# EAGLE design SIngle_Breakout_X128_0002 (EAGLE 7.2.0)
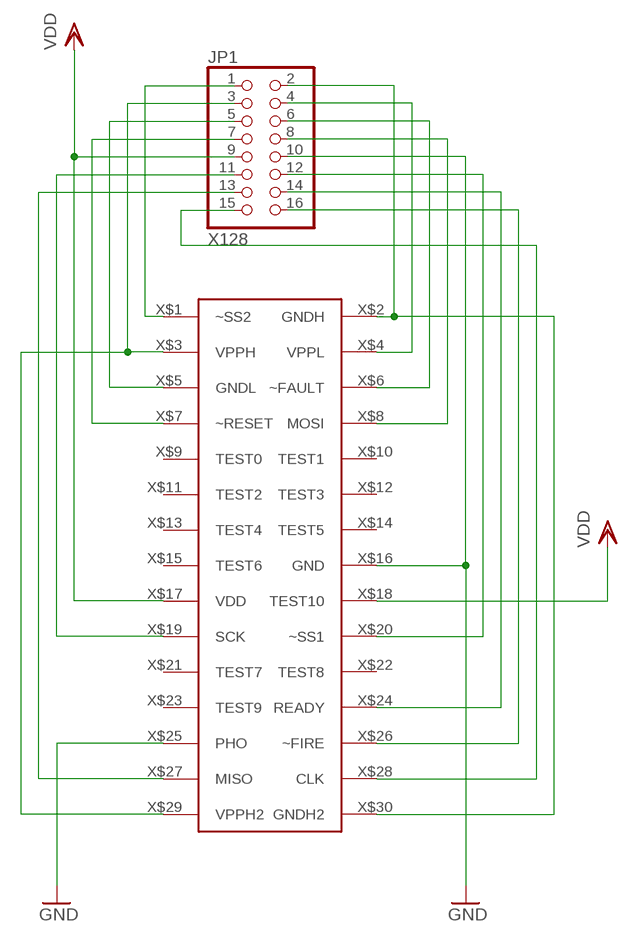
[diagram p0: schematic, sheet 1]

## Parts
JP1  X128  PINHD-2X8  [2X08]
U$1  XAAR_CONN_PHYS  [XAAR_128]

## Nets
GND: JP1.10 U$1.X$16(GND) U$1.X$25(PHO)
N$1: JP1.1 U$1.X$1(~SS2)
N$2: JP1.3 U$1.X$3(VPPH) U$1.X$29(VPPH2)
N$3: JP1.5 U$1.X$5(GNDL)
N$4: JP1.7 U$1.X$7(~RESET)
N$6: JP1.11 U$1.X$19(SCK)
N$7: JP1.13 U$1.X$27(MISO)
N$9: JP1.2 U$1.X$2(GNDH) U$1.X$30(GNDH2)
N$10: JP1.4 U$1.X$4(VPPL)
N$11: JP1.6 U$1.X$6(~FAULT)
N$12: JP1.8 U$1.X$8(MOSI)
N$14: JP1.12 U$1.X$20(~SS1)
N$15: JP1.14 U$1.X$24(READY)
N$16: JP1.16 U$1.X$26(~FIRE)
N$17: JP1.15 U$1.X$28(CLK)
VDD: JP1.9 U$1.X$17(VDD) U$1.X$18(TEST10)
Unconnected: U$1.X$9(TEST0) U$1.X$10(TEST1) U$1.X$11(TEST2) U$1.X$12(TEST3) U$1.X$13(TEST4) U$1.X$14(TEST5) U$1.X$15(TEST6) U$1.X$21(TEST7) U$1.X$22(TEST8) U$1.X$23(TEST9)

## Library data of the parts
JP1 = pinhead:PINHD-2X8: PIN HEADER
U$1 = matt4eagle:XAAR_CONN_PHYS

## Board
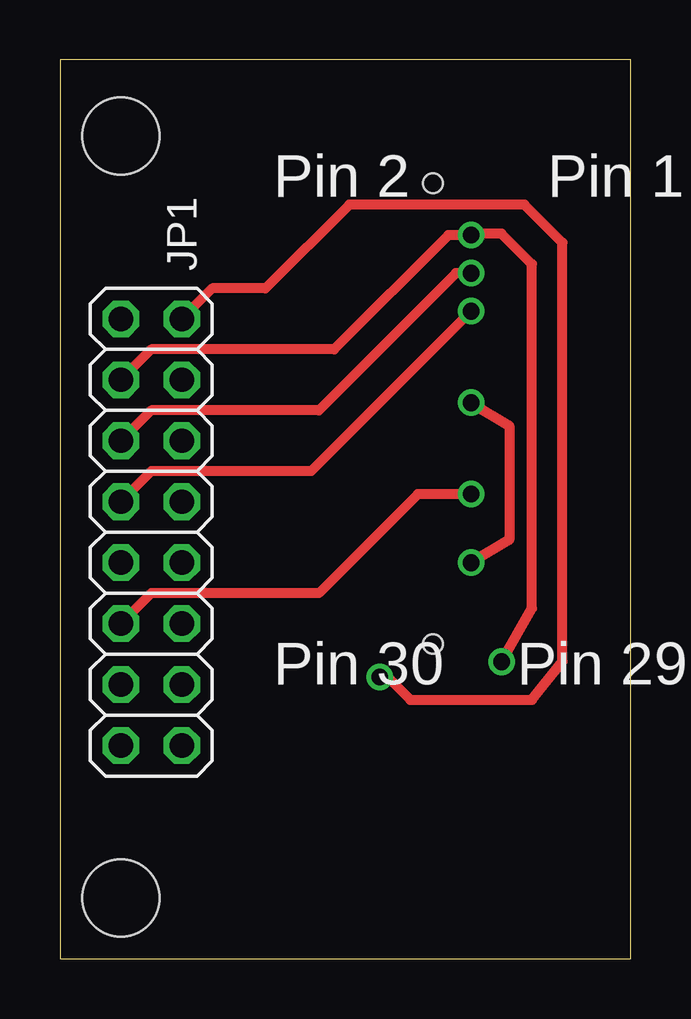
[diagram p1: board, top side]
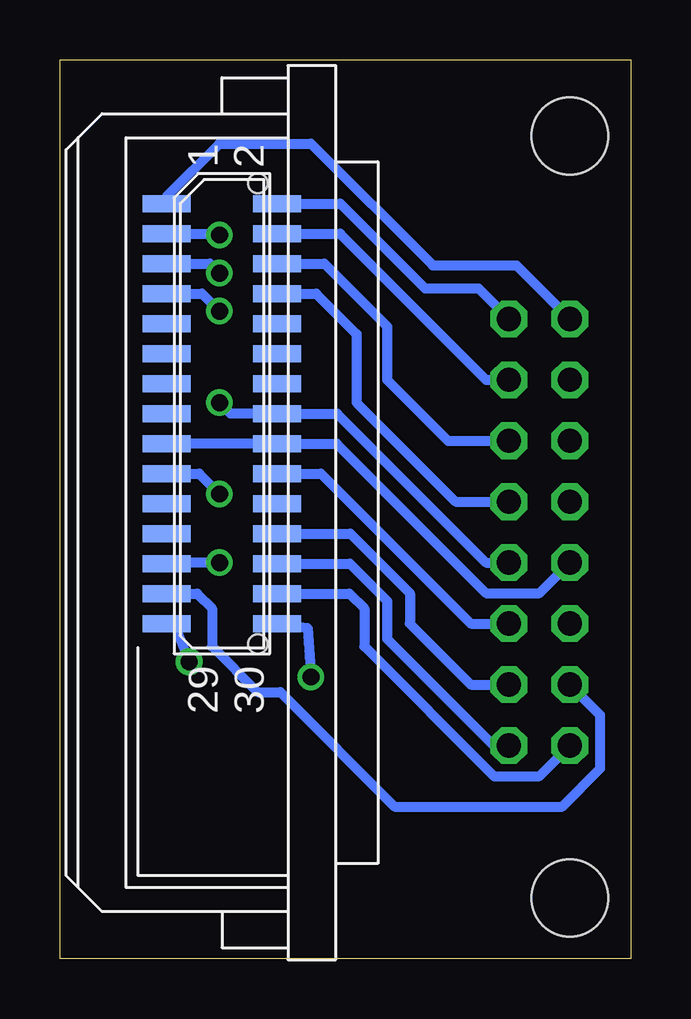
[diagram p2: board, bottom side, seen from below]

Size 23.8 x 37.45 mm. Coordinates in mm from the lower left corner, seen from the top.
Outline: 0,0 23.8,0 23.8,37.45 0,37.45 0,0
Copper layers (1*16): Top 0.035mm / dielectric 1.5mm / Bottom 0.035mm
Design rules "default": minimum track width 10mil, minimum drill 24mil, track to track 8mil, track to pad 8mil, pad to pad 8mil, via to via 8mil, smd to smd 8mil, copper to edge 40mil, drill to drill 8mil, minimum pad ring 10mil, minimum via ring 8mil, stop-mask expansion 4mil, vias tented up to drill 0mil, thermal gap 10mil
Holes 3.2 mm at 2.54,34.29 2.54,2.54

### Footprints (pad centres in the part's own frame; a part is rotated, then mirrored left to right if it is on the bottom)
2X08 = drill 1.016 octagon: 1 -8.89,-1.27; 2 -8.89,1.27; 3 -6.35,-1.27; 4 -6.35,1.27; 5 -3.81,-1.27; 6 -3.81,1.27; 7 -1.27,-1.27; 8 -1.27,1.27; 9 1.27,-1.27; 10 1.27,1.27; 11 3.81,-1.27; 12 3.81,1.27; 13 6.35,-1.27; 14 6.35,1.27; 15 8.89,-1.27; 16 8.89,1.27
XAAR_128 = smd 0.7 x 2: X$1 17.5,0.3; X$2 17.5,-4.3; X$3 16.25,0.3; X$4 16.25,-4.3; X$5 15,0.3; X$6 15,-4.3; X$7 13.75,0.3; X$8 13.75,-4.3; X$9 12.5,0.3; X$10 12.5,-4.3; X$11 11.25,0.3; X$12 11.25,-4.3; X$13 10,0.3; X$14 10,-4.3; X$15 8.75,0.3; X$16 8.75,-4.3; X$17 7.5,0.3; X$18 7.5,-4.3; X$19 6.25,0.3; X$20 6.25,-4.3; X$21 5,0.3; X$22 5,-4.3; X$23 3.75,0.3; X$24 3.75,-4.3; X$25 2.5,0.3; X$26 2.5,-4.3; X$27 1.25,0.3; X$28 1.25,-4.3; X$29 0,0.3; X$30 0,-4.3 | hole 0.8: -0.85,-3.5; 18.35,-3.5

### Placement (x,y rotation side)
JP1  3.81,17.78 270 top
U$1  19.05,13.97 90 bottom

### Tracks (layer width: path | path; a pad name or v marks a point on that pad's centre or on a via)
GND  (via drill 0.7)
  Top 0.406: v17.14,23.18 18.73,22.23 18.73,17.46 v17.14,16.51
  Bottom 0.406: JP1.10 6.03,16.51 12.24,22.72 U$1.X$16 16.69,22.72 v17.14,23.18 | v17.14,16.51 19.31,16.51 U$1.X$25
N$1
  Bottom 0.406: U$1.X$1 19.35,31.77 17.14,33.97 13.34,33.97 8.26,28.89 4.76,28.89 JP1.1
N$2  (via drill 0.7)
  Top 0.406: JP1.3 3.81,25.4 11.43,25.4 16.19,30.16 v17.14,30.16 17.2,30.22 18.41,30.22 19.68,28.95 19.68,14.61 v18.41,12.38
  Bottom 0.406: U$1.X$3 17.2,30.22 v17.14,30.16 | U$1.X$29 19.05,13.97 v18.41,12.38
N$3  (via drill 0.7)
  Top 0.406: v17.14,28.58 16.51,28.58 10.79,22.86 3.81,22.86 JP1.5
  Bottom 0.406: U$1.X$5 17.54,28.97 v17.14,28.58
N$4  (via drill 0.7)
  Top 0.406: v17.14,26.99 10.48,20.32 3.81,20.32 JP1.7
  Bottom 0.406: U$1.X$7 17.88,27.72 v17.14,26.99
N$6  (via drill 0.7)
  Top 0.406: v17.14,19.37 14.92,19.37 10.79,15.24 3.81,15.24 JP1.11
  Bottom 0.406: U$1.X$19 18,20.22 v17.14,19.37
N$7
  Bottom 0.406: U$1.X$27 18.08,15.22 17.46,14.61 17.46,13.02 15.56,11.11 14.61,11.11 9.84,6.35 2.86,6.35 1.27,7.94 1.27,10.16 JP1.13
N$9  (via drill 0.7)
  Top 0.406: v13.34,11.75 13.65,11.75 14.61,10.8 19.68,10.8 20.95,12.38 20.95,29.84 19.37,31.43 12.06,31.43 8.57,27.94 6.35,27.94 JP1.2
  Bottom 0.406: U$1.X$2 12.1,31.47 8.57,27.94 6.35,27.94 JP1.2 | U$1.X$30 13.48,13.8 v13.34,11.75
N$10
  Bottom 0.406: U$1.X$4 12.12,30.22 6.03,24.13 JP1.4
N$11
  Bottom 0.406: U$1.X$6 12.78,28.97 10.16,26.35 10.16,24.13 7.62,21.59 JP1.6
N$12
  Bottom 0.406: U$1.X$8 13.12,27.72 11.43,26.04 11.43,23.18 7.3,19.05 JP1.8
N$14
  Bottom 0.406: U$1.X$20 12.92,20.22 6.67,13.97 JP1.12
N$15
  Bottom 0.406: U$1.X$24 11.69,17.72 9.21,15.24 9.21,13.97 6.67,11.43 JP1.14
N$16
  Bottom 0.406: U$1.X$26 11.71,16.47 10.16,14.92 10.16,13.34 5.71,8.89 JP1.16
N$17
  Bottom 0.406: U$1.X$28 11.73,15.22 11.11,14.61 11.11,13.02 5.71,7.62 3.81,7.62 JP1.15
VDD
  Bottom 0.406: U$1.X$17 U$1.X$18 12.26,21.47 6.03,15.24 3.81,15.24 JP1.9

### Text on the board
tNames: Pin 2 | Pin 1 | Pin 30 | Pin 29
tDocu: ~SS2 | GNDH | VPPH | VPPL | GNDL | FAULT~ | ~RST | MOSI | VDD | GND | SCK | SS1~ | MISO | READY | CLK | FIRE~